# Altium schematic sheet lab_1_larionov_usb_rs232.SchDoc: =title_line_1 + title_line_2
size 594 x 420 mm; SheetNumber: 1
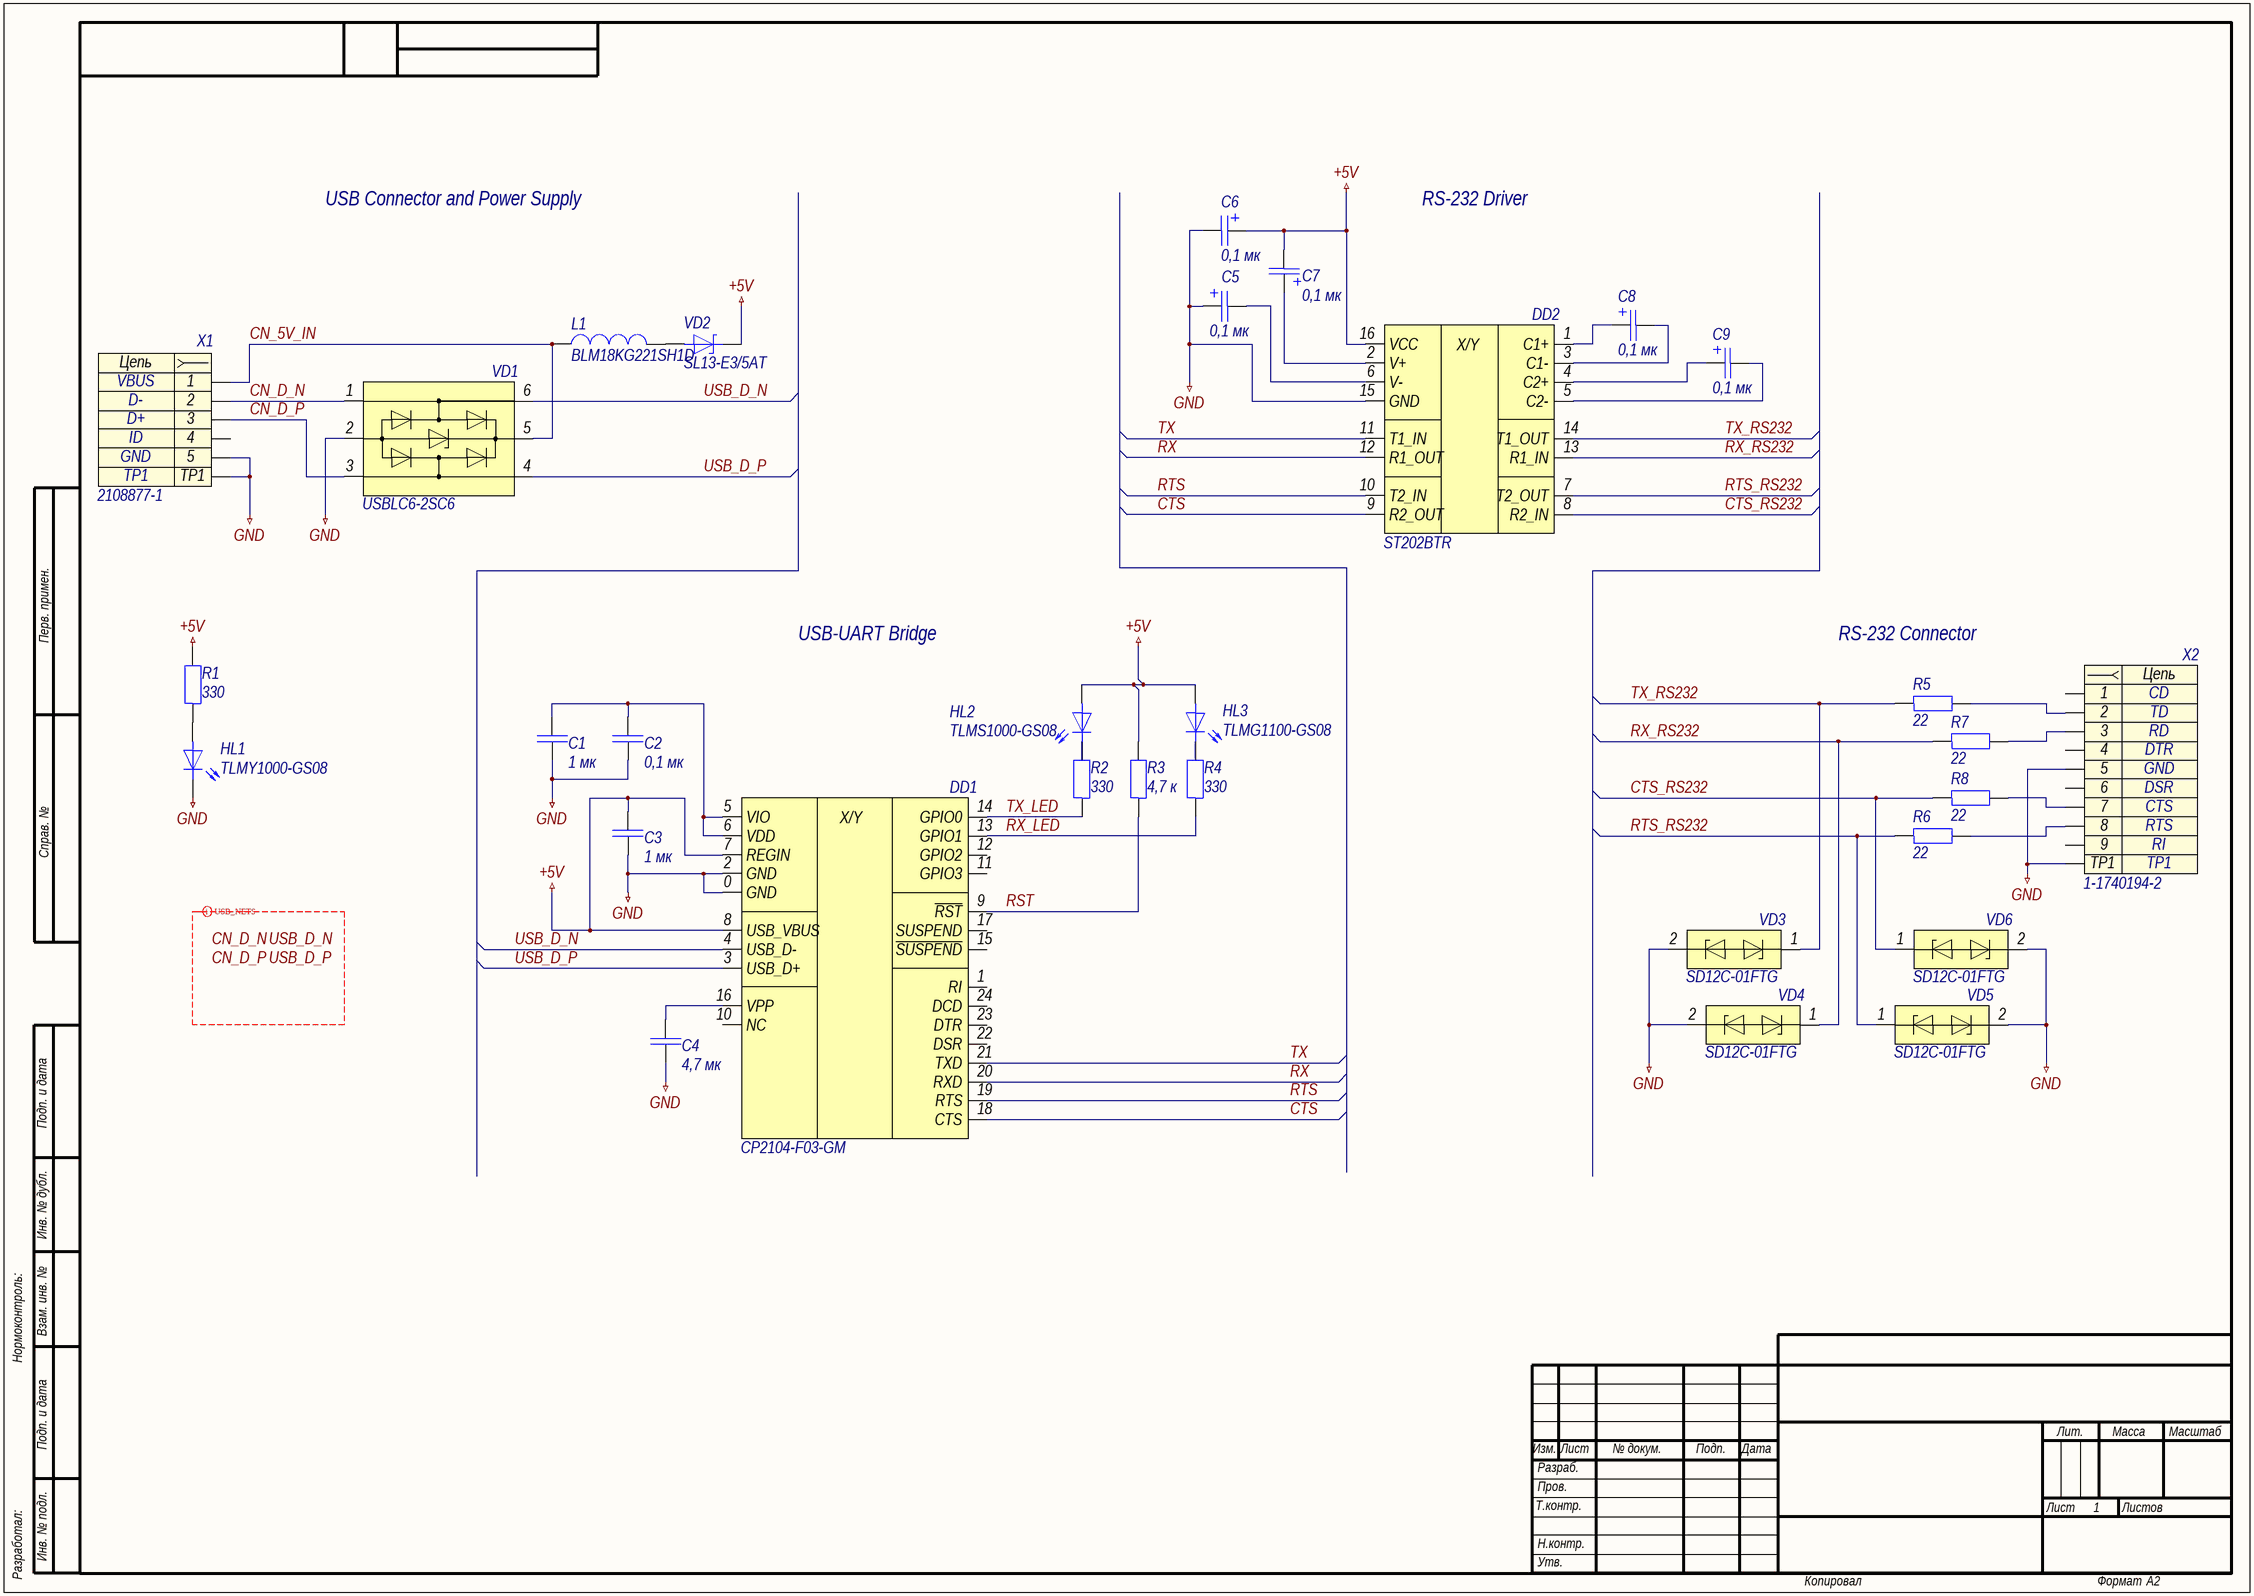
[diagram p0: lab_1_larionov_usb_rs232.SchDoc]

## Parts
C1  1 мк  [C0603]
C2  0,1 мк  [C0603]
C3  1 мк  [C0603]
C4  4,7 мк  [C0603]
C5  0,1 мк  [C1206POLAR]
C6  0,1 мк  [C1206POLAR]
C7  0,1 мк  [C1206POLAR]
C8  0,1 мк  [C1206POLAR]
C9  0,1 мк  [C1206POLAR]
DD1  CP2104-F03-GM  [QFN-24]
DD2  ST202BTR  [TSSOP-16]
HL1  TLMY1000-GS08  [HL0603]
HL2  TLMS1000-GS08  [HL0603]
HL3  TLMG1100-GS08  [HL0603]
L1  BLM18KG221SH1D  [FERRITE-BEAD]
R1  330  [R0603]
R2  330  [R0603]
R3  4,7 к  [R0603]
R4  330  [R0603]
R5  22  [R0603]
R6  22  [R0603]
R7  22  [R0603]
R8  22  [R0603]
VD1  USBLC6-2SC6  [SOT23-6L]
VD2  SL13-E3/5AT  [DO-214AC]
VD3  SD12C-01FTG  [SOD323]
VD4  SD12C-01FTG  [SOD323]
VD5  SD12C-01FTG  [SOD323]
VD6  SD12C-01FTG  [SOD323]
X1  2108877-1  [2108877-1]
X2  1-1740194-2  [1-1740194-2]

## Nets
+5V: C3.2 C6.1 C7.2 DD1.7(REGIN) DD1.8(USB_VBUS) DD2.16(VCC) HL2.2 HL3.2 R1.2 R3.2 VD2.1
GND: C1.1 C2.1 C3.1 C4.1 C5.1 C6.2 DD1.0(GND) DD1.2(GND) DD2.15(GND) HL1.1 VD1.2 VD3.2 VD4.2 VD5.2 VD6.2 X1.5 X1.TP1 X2.5 X2.TP1
CN_5V_IN: L1.1 VD1.5 X1.1
CN_D_N: VD1.1 X1.2
CN_D_P: VD1.3 X1.3
CTS: DD1.18(CTS) DD2.9(R2_OUT)
CTS_RS232: DD2.8(R2_IN) R8.1 VD6.1
RST: DD1.9(~{RST}) R3.1
RTS: DD1.19(RTS) DD2.10(T2_IN)
RTS_RS232: DD2.7(T2_OUT) R6.1 VD5.1
RX: DD1.20(RXD) DD2.12(R1_OUT)
RX_LED: DD1.13(GPIO1) R4.1
RX_RS232: DD2.13(R1_IN) R7.1 VD4.1
TX: DD1.21(TXD) DD2.11(T1_IN)
TX_LED: DD1.14(GPIO0) R2.1
TX_RS232: DD2.14(T1_OUT) R5.1 VD3.1
USB_D_N: DD1.4(USB_D-) VD1.6
USB_D_P: DD1.3(USB_D+) VD1.4
NetC1_2: C1.2 C2.2 DD1.5(VIO) DD1.6(VDD)
NetC4_2: C4.2 DD1.16(VPP)
NetC5_2: C5.2 DD2.6(V-)
NetC7_1: C7.1 DD2.2(V+)
NetC8_1: C8.1 DD2.1(C1+)
NetC8_2: C8.2 DD2.3(C1-)
NetC9_1: C9.1 DD2.4(C2+)
NetC9_2: C9.2 DD2.5(C2-)
NetHL1_2: HL1.2 R1.1
NetHL2_1: HL2.1 R2.2
NetHL3_1: HL3.1 R4.2
NetL1_2: L1.2 VD2.2
NetR5_2: R5.2 X2.2
NetR6_2: R6.2 X2.8
NetR7_2: R7.2 X2.3
NetR8_2: R8.2 X2.7

Not connected (* = marked no-connect by the designer): DD1 1(RI) 10(NC) 11(GPIO3) 12(GPIO2) 15(~{SUSPEND}) 17(SUSPEND) 22(DSR) 23(DTR) 24(DCD); X1 4; X2 1 4 6 9

## Layout directives
differential pair; differential pair class USB_SIGNALS; rule Differential Pairs Routing [Pref Gap = 0.254mm    Min Gap  = 0.15mm    Max Gap  = 0.254mmPref Width = 0.381mm    Min Width  = 0.155mm    Max Width  = 0.381mm]: CN_D_N, CN_D_P, USB_D_N, USB_D_P

## Notes on the sheet
- USB Connector and Power Supply
- RS-232 Driver
- USB-UART Bridge
- RS-232 Connector
- Labels drawn without touching a wire or pin: CN_D_N, CN_D_P, USB_D_N, USB_D_P
- Перв. примен.
- Справ. №
- Подп. и дата
- Инв. № дубл.
- Нормоконтроль:
- Взам. инв. №
- Изм.
- Лист
- № докум.
- Подп.
- Дата
- Лит.
- Масса
- Масштаб
- Т.контр.
- Пров.
- Разраб.
- Листов
- Разработал:
- Инв. № подл.
- Н.контр.
- Утв.
- Копировал
- Формат
- А2
- (in symbol dd0001) X/Y
- (in symbol dd0002) X/Y
- (in symbol x0001) Цепь
- (in symbol x0002) Цепь

## Library data of the parts
C1 C3 = c0003: =Описание; ID: c0003; Фамилия: Ларионов; Описание: Конденсатор чип 0603 1 мкФ 25 В ±10 %; Наименование: CC0603KRX7R8BB105; Производитель: Yageo; Отклонение: ±10 %; Номинальное напряжение: 25 В; Рабочие температуры: от -55 °С до +125 °С; Корпус: 0603; Номинал: 1 мк; HelpURL: https://www.yageo.com/upload/media/product/products/datasheet/mlcc/UPY-GPHC_X7R_6.3V-to-50V_20.pdf
C2 = c0002: =Описание; ID: c0002; Фамилия: Ларионов; Описание: Конденсатор чип 0603 0,1 мкФ 50 В ±10 %; Наименование: CC0603JRX7R9BB104; Производитель: Yageo; Отклонение: ±5 %; Номинальное напряжение: 50 В; Рабочие температуры: от -55 °С до +125 °С; Корпус: 0603; Номинал: 0,1 мк; HelpURL: https://www.yageo.com/upload/media/product/products/datasheet/mlcc/UPY-GPHC_X7R_6.3V-to-50V_20.pdf
C4 = c0006: =Описание; ID: c0006; Фамилия: Ларионов; Описание: Конденсатор чип 0603 4,7 мкФ 25 В ±10 %; Наименование: CC0603KRX5R8BB475; Производитель: Yageo; Отклонение: ±10 %; Номинальное напряжение: 25 В; Рабочие температуры: от -55 °С до +85 °С; Корпус: 0603; Номинал: 4,7 мк; HelpURL: https://www.yageo.com/upload/media/product/productsearch/datasheet/mlcc/UPY-GPHC_X5R_4V-to-50V_26.pdf
C5-C9 = c0005: =Описание; ID: c0005; Фамилия: Ларионов; Описание: Конденсатор чип 1206 0,1 мкФ 50 В ±10 % полярный; Наименование: 293D104X9050A2TE3; Производитель: Vishay Intertechnology, Inc.; Отклонение: ±10 %; Номинальное напряжение: 50 В; Рабочие температуры: от -55 °С до +125 °С; Корпус: 1206; Номинал: 0,1 мк; HelpURL: https://www.vishay.com/capacitors/list/product-40002/
DD1 = dd0001: =Описание; ID: dd0001; Фамилия: Ларионов; Описание: Преобразователь USB-UART; Производитель: Silicon Laboratories Inc.; Наименование: CP2104-F03-GM; Корпус: QFN-24; HelpURL: https://www.silabs.com/interface/usb-bridges/classic/device.cp2104
DD2 = dd0002: =Описание; ID: dd0002; Фамилия: Ларионов; Описание: Многоканальный драйвер RS-232; Производитель: STMicroelectronics; Корпус: TSSOP16; Наименование: ST202BTR; HelpURL: https://www.st.com/content/st_com/en/products/interfaces-and-transceivers/rs-232/st202b.html
HL1 = hl0003: =Описание; ID: hl0003; Фамилия: Ларионов; Описание: Светодиод чип 0603 желтый; Производитель: Vishay Intertechnology, Inc.; Цвет: Yellow; Номинальная сила света: 7,5 мкд; Номинальная длина волны: 588 нм; Номинальный прямой ток: 15 мА; Номинальное падение напряжение: 1,8 В; Рассеиваемая мощность: 40 мВт; Рабочие температуры: от -40 °С до +100 °С; Корпус: 0603; Наименование: TLMY1000-GS08; HelpURL: https://www.vishay.com/leds/list/product-83172/
HL2 = hl0001: =Описание; ID: hl0001; Фамилия: Ларионов; Описание: Светодиод чип 0603 красный; Производитель: Vishay Intertechnology, Inc.; Цвет: Red; Номинальная сила света: 4 мкд; Номинальная длина волны: 628 нм; Номинальный прямой ток: 15 мА; Номинальное падение напряжение: 1,8 В; Рассеиваемая мощность: 40 мВт; Рабочие температуры: от -40 °С до +100 °С; Корпус: 0603; Наименование: TLMS1000-GS08; HelpURL: https://www.vishay.com/leds/list/product-83172/
HL3 = hl0005: =Описание; ID: hl0005; Фамилия: Ларионов; Описание: Светодиод чип 0603 зеленый; Производитель: Vishay Intertechnology, Inc.; Цвет: Green; Номинальная сила света: 35 мкд; Номинальная длина волны: 570 нм; Номинальный прямой ток: 30 мА; Номинальное падение напряжение: 2,1 В; Рассеиваемая мощность: 90 мВт; Рабочие температуры: от -40 °С до +100 °С; Корпус: 0603; Наименование: TLMG1100-GS08; HelpURL: https://www.vishay.com/leds/list/product-83173/
L1 = l0001: =Описание; ID: l0001; Фамилия: Ларионов; Описание: Ферритовая бусина 220 Ом ±25 %; Производитель: Murata Manufacturing Co., Ltd.; Сопротивление, 100 МГц: 220 Ом; Отклонение, 100 Мгц: ±25 %; Сопротивление при постоянном токе: 0,05 Ом; Рабочие температуры: от -55 °С до +125 °С; Корпус: 0603; Наименование: BLM18KG221SH1D; HelpURL: https://www.murata.com/en-global/products/productdetail.aspx?partno=BLM18KG221SH1%23
R1 R2 R4 = r0005: =Описание; ID: r0005; Фамилия: Ларионов; Описание: Резистор чип 0603 330 Ом ±1 % 0,1 Вт; Наименование: RC0603FR-07330RL; Производитель: Yageo; Отклонение: ±1 %; Номинальное напряжение: 75 В; Рабочие температуры: от -55 °С до +155 °С; Номинальный ток: 1 А; Корпус: 0603; Номинал: 330; HelpURL: https://www.yageo.com/upload/media/product/productsearch/datasheet/rchip/PYu-RC_Group_51_RoHS_L_11.pdf
R3 = r0006: =Описание; ID: r0006; Фамилия: Ларионов; Описание: Резистор чип 0603 4,7 кОм ±1 % 0,1 Вт; Наименование: RC0603FR-074K7L; Производитель: Yageo; Отклонение: ±1 %; Номинальное напряжение: 75 В; Рабочие температуры: от -55 °С до +155 °С; Номинальный ток: 1 А; Корпус: 0603; Номинал: 4,7 к; HelpURL: https://www.yageo.com/upload/media/product/productsearch/datasheet/rchip/PYu-RC_Group_51_RoHS_L_11.pdf
R5-R8 = r0003: =Описание; ID: r0003; Фамилия: Ларионов; Описание: Резистор чип 0603 22 Ом ±1 % 0,1 Вт; Наименование: RC0603FR-0722R; Производитель: Yageo; Отклонение: ±1 %; Номинальное напряжение: 75 В; Рабочие температуры: от -55 °С до +155 °С; Номинальный ток: 1 А; Корпус: 0603; Номинал: 22; HelpURL: https://www.yageo.com/upload/media/product/productsearch/datasheet/rchip/PYu-RC_Group_51_RoHS_L_11.pdf
VD1 = vd0003: =Описание; ID: vd0003; Фамилия: Ларионов; Описание: Диодная сборка для подавления помех, от 6 В; Производитель: STMicroelectronics; Наименование: USBLC6-2SC6; Корпус: SOT23-6L; HelpURL: https://www.st.com/content/st_com/en/products/protection-devices/esd-protection/usb-port-protection/usblc6-2.html
VD2 = vd0001: =Описание; ID: vd0001; Фамилия: Ларионов; Описание: Диод Шоттки 30 В 1,5 А; Производитель: Vishay Intertechnology, Inc.; Пиковое прямое напряжение: 0,445 В; Импульсное обратное напряжение: 30 В; Макс# допустимый средний прямой ток: 1,5 А; Рабочие температуры: от -55 °С до +125 °С; Наименование: SL13-E3/5AT; Корпус: DO-214AC; HelpURL: https://www.vishay.com/product?docid=88740
VD3-VD6 = vd0002: =Описание; ID: vd0002; Фамилия: Ларионов; Описание: Двунаправленная диодная сборка для подавления помех, 12 В; Производитель: Littelfuse, Inc.; Наименование: SD12C-01FTG; Корпус: SOD323; HelpURL: https://www.littelfuse.com/products/tvs-diode-arrays/general-purpose-esd-protection/sdc/sd12c_01ftg.aspx
X1 = x0001: Contact_1: VBUS; Contact_2: D-; Contact_3: D+; Contact_4: ID; Contact_5: GND; ID: x0001; Фамилия: Ларионов; Описание: USB 2.0 Micro USB Type B IP68 гнездо прямой угол; Производитель: TE Connectivity; Наименование: 2108877-1; HelpURL: https://www.te.com/global-en/product-2108877-1.html
X2 = x0002: Contact_1: CD; Contact_2: TD; Contact_3: RD; Contact_4: DTR; Contact_5: GND; Contact_6: DSR; Contact_7: CTS; Contact_8: RTS; Contact_9: RI; ID: x0002; Фамилия: Ларионов; Описание: D-Sub 9 pin Board-to-Board; Производитель: TE Connectivity; Наименование: 1-1740194-2; HelpURL: https://www.te.com/global-en/product-1-1740194-2.html